# EAGLE design LED Balloon_driver IC (EAGLE 9.6.2)
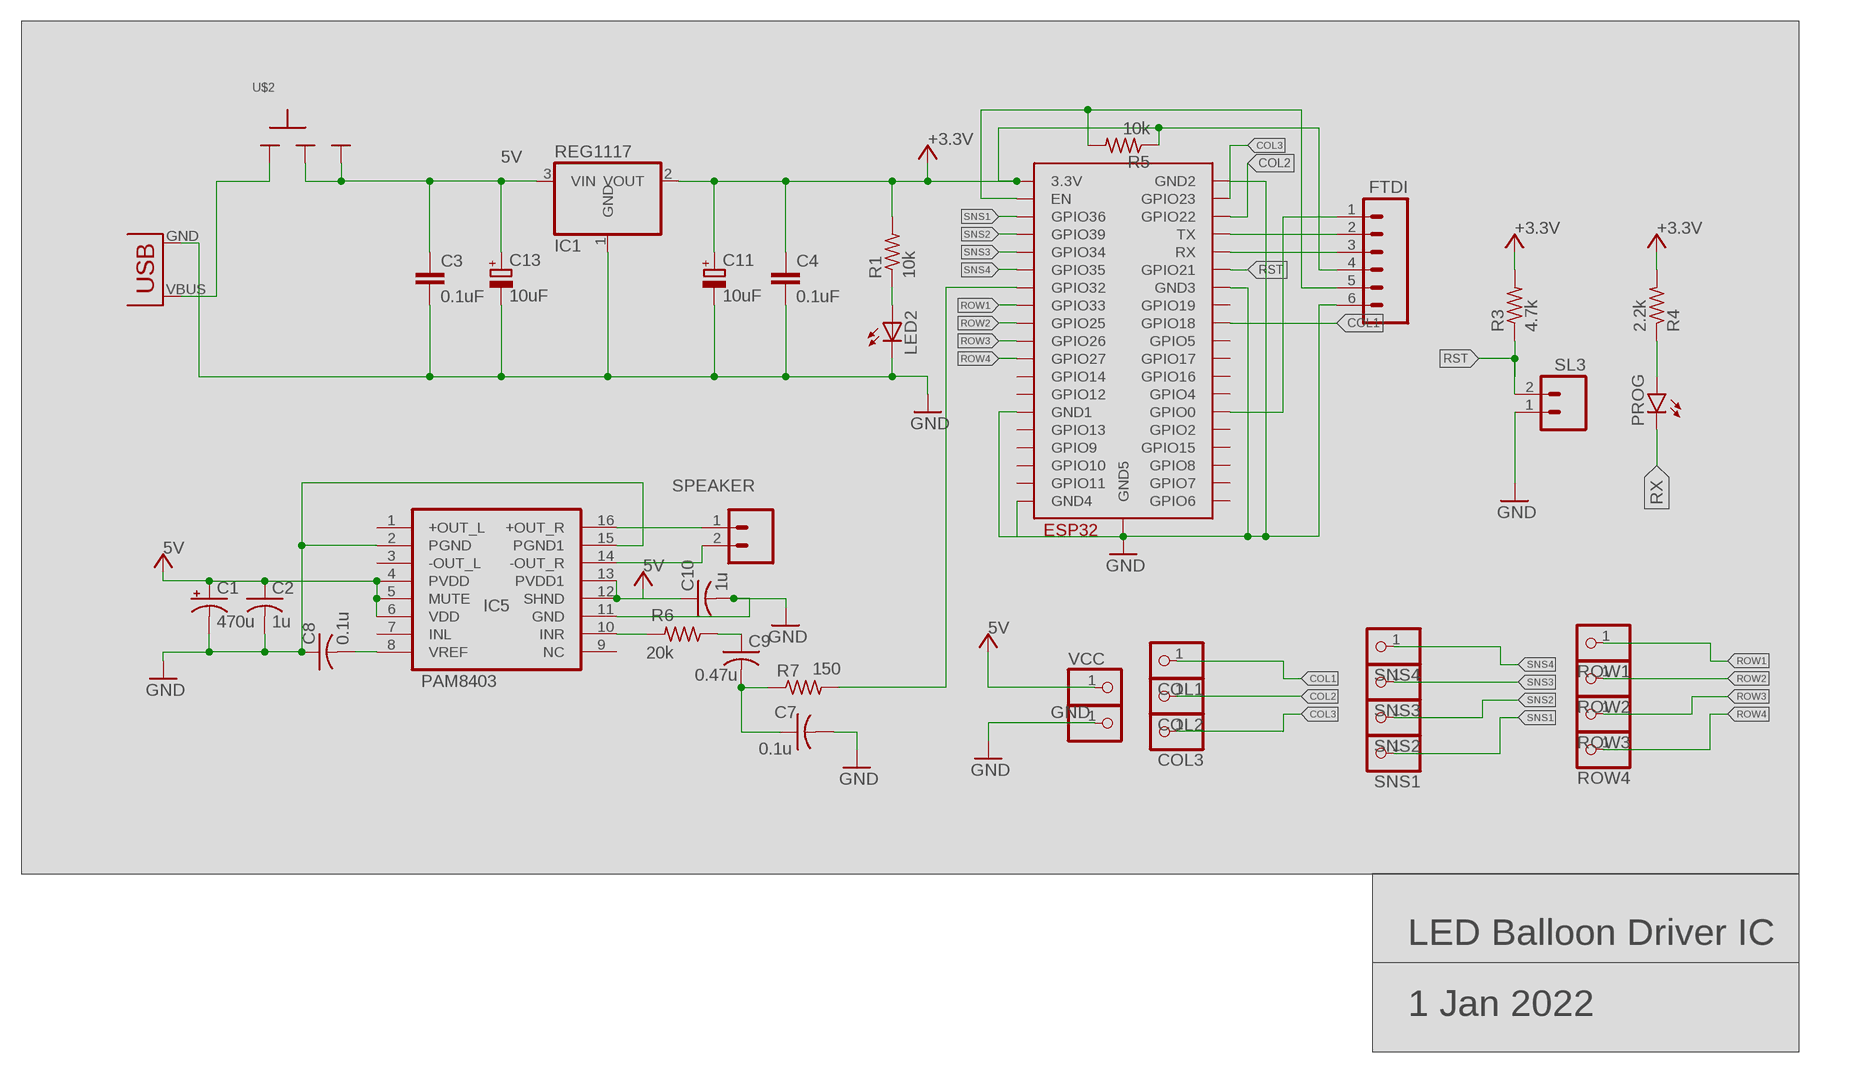
[diagram p0: schematic, sheet 1]

## Parts
C1  470u  CPOL-USE5-10.5  [E5-10,5]
C2  1u  CAP0805  [C0805]
C3  0.1uF  C2,5-3  [C2.5-3]
C4  0.1uF  C2,5-3  [C2.5-3]
C7  0.1u  CAP0805  [C0805]
C8  0.1u  CAP0805  [C0805]
C9  0.47u  CAP0805  [C0805]
C10  1u  CAP0805  [C0805]
C11  10uF  CPOL-EUE2-5  [E2-5]
C13  10uF  CPOL-EUE2-5  [E2-5]
COL1  PINHD-1X1  [1X01]
COL2  PINHD-1X1  [1X01]
COL3  PINHD-1X1  [1X01]
ESP32_MODULE  ESP32-WROOM  [ESP32-WROOM]
GND  PINHD-1X1  [1X01]
IC1  REG1117  [SOT223]
IC5  PAM8403  [SOP-16]
LED2  LED5MM  [LED5MM]
PROG  LED-RED0603  [0603-RED]
R1  10k  RESISTOR0207/7  [0207/7]
R3  4.7k  RESISTOR0207/7  [0207/7]
R4  2.2k  RESISTOR0805  [R0805]
R5  10k  RESISTOR0805  [R0805]
R6  20k  R-US_0207/10  [0207/10]
R7  150  R-US_0207/10  [0207/10]
ROW1  PINHD-1X1  [1X01]
ROW2  PINHD-1X1  [1X01]
ROW3  PINHD-1X1  [1X01]
ROW4  PINHD-1X1  [1X01]
SL1  FTDI  M06  [06P]
SL3  M02  [02P]
SNS1  PINHD-1X1  [1X01]
SNS2  PINHD-1X1  [1X01]
SNS3  PINHD-1X1  [1X01]
SNS4  PINHD-1X1  [1X01]
SPEAKER  M02  [02P]
U$1  USB(POWER)  [USB(POWER)]
U$2  SLIDESWITCH-BIG  [BIGSWITCH]
VCC  PINHD-1X1  [1X01]

## Nets
5V: C1.+ C2.1 C3.1 C10.1 C13.+ IC1.3(VIN) IC5.4(PVDD) IC5.5(MUTE) IC5.6(VDD) IC5.12(SHND) IC5.13(PVDD1) U$2.2 U$2.3 VCC.1 ; supply symbol labelled VCC
+3.3V: C4.1 C11.+ ESP32_MODULE.3V3(3.3V) IC1.2(VOUT) R1.2 R3.2 R4.2 R5.1 SL1.4 ; supply symbol labelled VCC
COL1: COL1.1 ESP32_MODULE.IO18(GPIO18)
COL2: COL2.1 ESP32_MODULE.IO22(GPIO22)
COL3: COL3.1 ESP32_MODULE.IO23(GPIO23)
EN: ESP32_MODULE.EN R5.2 SL1.5
GND: C1.- C2.2 C3.2 C4.2 C7.2 C8.1 C10.2 C11.- C13.- ESP32_MODULE.GND1 ESP32_MODULE.GND2 ESP32_MODULE.GND3 ESP32_MODULE.GND4 ESP32_MODULE.GND5 GND.1 IC1.1(GND) IC5.2(PGND) IC5.11(GND) IC5.15(PGND1) LED2.K(C) SL1.6 SL3.1 U$1.GND
N$1: IC5.16(+OUT_R) SPEAKER.1
N$2: IC5.10(INR) R6.2
N$3: C8.2 IC5.8(VREF)
N$4: PROG.A R4.1
N$5: C9.1 R6.1
N$6: ESP32_MODULE.IO0(GPIO0) SL1.1
N$8: IC5.14(-OUT_R) SPEAKER.2
N$9: LED2.A R1.1
N$10: C7.1 C9.2 R7.1
N$11: U$1.VBUS(VCC) U$2.1
PWM: ESP32_MODULE.IO32(GPIO32) R7.2
ROW1: ESP32_MODULE.IO33(GPIO33) ROW1.1
ROW2: ESP32_MODULE.IO25(GPIO25) ROW2.1
ROW3: ESP32_MODULE.IO26(GPIO26) ROW3.1
ROW4: ESP32_MODULE.IO27(GPIO27) ROW4.1
RST: ESP32_MODULE.IO21(GPIO21) R3.1 SL3.2
RX: ESP32_MODULE.RX PROG.C SL1.3
SNS1: ESP32_MODULE.SENSOR_VP(GPIO36) SNS1.1
SNS2: ESP32_MODULE.SENSOR_VN(GPIO39) SNS2.1
SNS3: ESP32_MODULE.IO34(GPIO34) SNS3.1
SNS4: ESP32_MODULE.IO35(GPIO35) SNS4.1
TX: ESP32_MODULE.TX SL1.2
Unconnected: ESP32_MODULE.CLK(GPIO6) ESP32_MODULE.CMD(GPIO11) ESP32_MODULE.IO2(GPIO2) ESP32_MODULE.IO4(GPIO4) ESP32_MODULE.IO5(GPIO5) ESP32_MODULE.IO12(GPIO12) ESP32_MODULE.IO13(GPIO13) ESP32_MODULE.IO14(GPIO14) ESP32_MODULE.IO15(GPIO15) ESP32_MODULE.IO16(GPIO16) ESP32_MODULE.IO17(GPIO17) ESP32_MODULE.IO19(GPIO19) ESP32_MODULE.SD0(GPIO7) ESP32_MODULE.SD1(GPIO8) ESP32_MODULE.SD2(GPIO9) ESP32_MODULE.SD3(GPIO10) IC5.1(+OUT_L) IC5.3(-OUT_L) IC5.7(INL) IC5.9(NC)

## Notes on the sheet
- LED Balloon Driver IC
- 1 Jan 2022

## Library data of the parts
C1 = rcl:CPOL-US: POLARIZED CAPACITOR, American symbol; SPICEPREFIX: C
C2 C7-C10 = CEDT_JANUARY_2015_v6:CAP
C3 C4 = capacitor-wima:C: CAPACITOR naming: grid - package width
C11 C13 = rcl:CPOL-EU: POLARIZED CAPACITOR, European symbol; SPICEPREFIX: C
COL1-COL3 GND ROW1-ROW4 SNS1-SNS4 VCC = adafruit:PINHD-1X1: Pin header 1x1 for 0.1" spacing With round pins
ESP32_MODULE = ESP32:ESP32-WROOM
IC1 = CEDT_JANUARY_2015_v6:REG1117: 800mA and 1A Low Dropout (LDO) Positive Regulator 1.8V, 2.5V, 2.85V, 3.3V, 5V, and Adj
IC5 = PAM8403:PAM8403: Dual channel audio amplifier IC - PAM8403
LED2 = adafruit:LED: LED OSRAM: - CHIPLED LG R971, LG N971, LY N971, LG Q971, LY Q971, LO R971, LY R971 LH N974, LH R974 LS Q976, LO Q976, LY Q976 LO Q996 - Hyper CHIPLED LW Q18S LB Q993, LB Q99A, LB R99A - SideLED LS A670, LO A670, LY A670, LG A670, LP A670 LB A673, LV A673, LT A673, LW A673 LH A674 LY A675 LS A676, LA A676, LO A676, LY A676, LW A676 LS A679, LY A679, LG A679 - Hyper Micro SIDELED® LS Y876, LA Y876, LO Y876, LY Y876 LT Y87S - SmartLED LW L88C, LW L88S LB L89C, LB L89S, LG L890 LS L89K, LO L89K, LY L89K LS L896, LA L896, LO L896, LY L896 - TOPLED LS T670, LO T670, LY T670, LG T670, LP T670 LSG T670, LSP T670, LSY T670, LOP T670, LYG T670 LG T671, LOG T671, LSG T671 LB T673, LV T673, LT T673, LW T673 LH T674 LS T676, LA T676, LO T676, LY T676, LB T676, LH T676, LSB T676, LW T676 LB T67C, LV T67C, LT T67C, LS T67K, LO T67K, LY T67K, LW E67C LS E67B, LA E67B, LO E67B, LY E67B, LB E67C, LV E67C, LT E67C LW T67C LS T679, LY T679, LG T679 LS T770, LO T770, LY T770, LG T770, LP T770 LB T773, LV T773, LT T773, LW T773 LH T774 LS E675, LA E675, LY E675, LS T675 LS T776, LA T776, LO T776, LY T776, LB T776 LHGB T686 LT T68C, LB T68C - Hyper Mini TOPLED® LB M676 - Mini TOPLED Santana® LG M470 LS M47K, LO M47K, LY M47K Source: http://www.osram.convergy.de/
PROG = BeagleBone_Blue_R3:LED-RED
R1 R3-R5 = CEDT_JANUARY_2015_v6:RESISTOR
R6 R7 = adafruit:R-US_: RESISTOR, American symbol
SL1 = con-amp-quick:M06: AMP QUICK CONNECTOR; OC_FARNELL: unknown; OC_NEWARK: unknown
SL3 = con-amp-quick:M02: AMP QUICK CONNECTOR; OC_FARNELL: unknown; OC_NEWARK: unknown
SPEAKER = CEDT_JANUARY_2015_v6:M02: AMP QUICK CONNECTOR
U$1 = CEDT_JANUARY_2015_v6:USB(POWER)
U$2 = CEDT_JANUARY_2015_v6:SLIDESWITCH

## Board
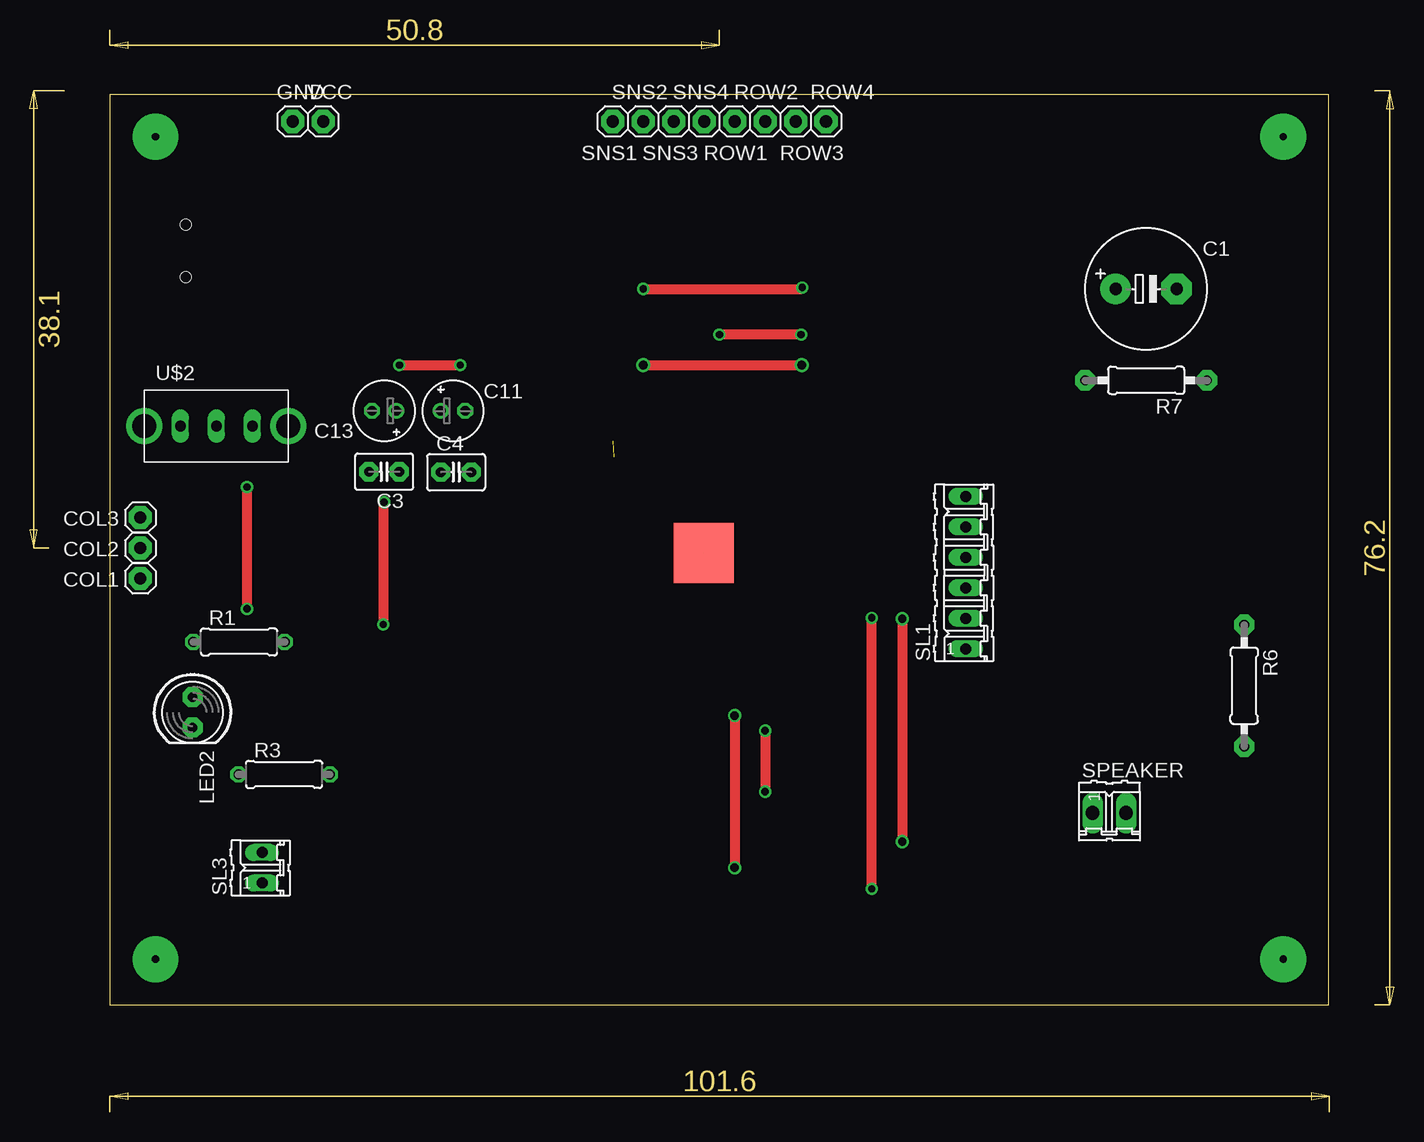
[diagram p1: board, top side]
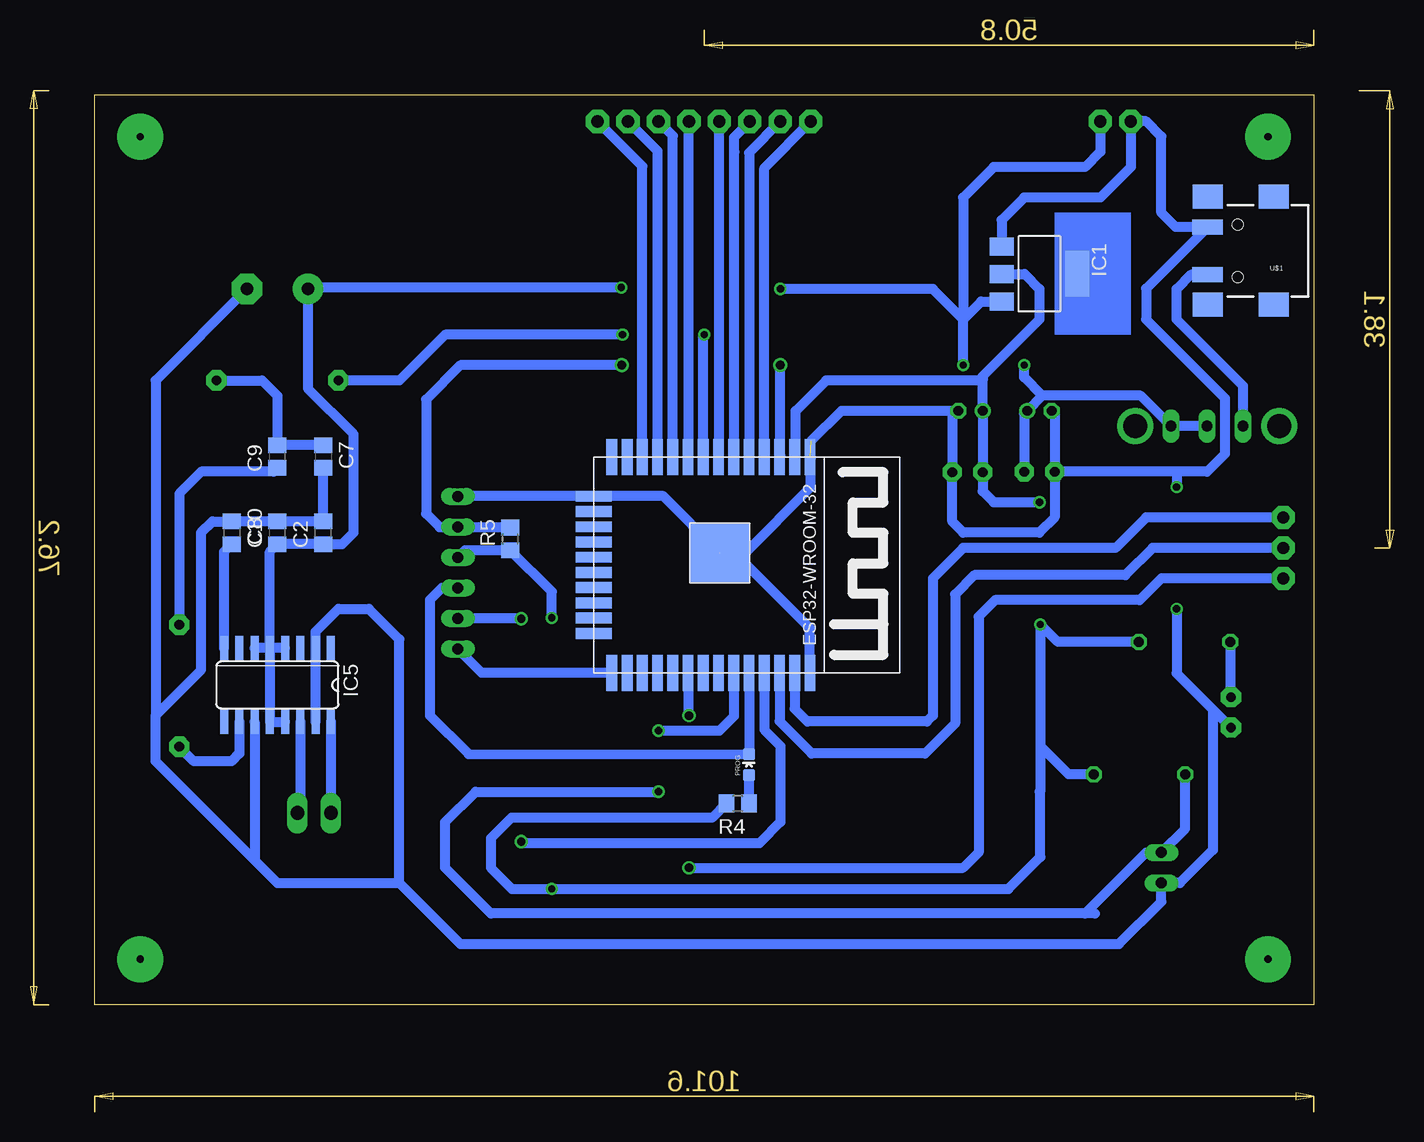
[diagram p2: board, bottom side, seen from below]

Size 101.58 x 75.87 mm. Coordinates in mm from the lower left corner, seen from the top.
Outline: 0,0 101.58,0 101.58,75.87 0,75.87 0,0
Copper layers (1*16): Top 0.035mm / dielectric 1.5mm / Bottom 0.035mm
Design rules "default": minimum track width 6mil, minimum drill 0.35mm, track to track 6mil, track to pad 6mil, pad to pad 6mil, via to via 6mil, smd to smd 6mil, copper to edge 40mil, drill to drill 6mil, minimum pad ring 10mil, minimum via ring 8mil, stop-mask expansion 4mil, vias tented up to drill 0mil, thermal gap 10mil

### Footprints (pad centres in the part's own frame; a part is rotated, then mirrored left to right if it is on the bottom)
E5-10,5 = drill 1.016 pad 2.54: + -2.54,0 | drill 1.016 pad 2.54 octagon: - 2.54,0
C0805 = smd 1.3 x 1.5: 1 -0.95,0; 2 0.95,0
C2.5-3 = drill 0.813 pad 1.6 octagon: 1 -1.27,0; 2 1.27,0
E2-5 = drill 0.813 pad 1.27: + -1.016,0 | drill 0.813 pad 1.27 octagon: - 1.016,0
1X01 = drill 1.016 pad 1.93 octagon: 1 0,0
ESP32-WROOM = smd 3 x 0.9: 3V3 0,16.74; EN 0,15.47; GND1 0,18.01; GND3 18,18.01; IO0 18,1.5; IO4 18,2.77; IO5 18,6.58; IO12 0,1.5; IO14 0,2.77; IO16 18,4.04; IO17 18,5.31; IO18 18,7.85; IO19 18,9.12; IO21 18,11.66; IO22 18,15.47; IO23 18,16.74; IO25 0,6.58; IO26 0,5.31; IO27 0,4.04; IO32 0,9.12; IO33 0,7.85; IO34 0,11.66; IO35 0,10.39; NC 18,10.39; RX 18,12.93; SENSOR_VN 0,12.93; SENSOR_VP 0,14.2; TX 18,14.2 | smd 0.9 x 3: CLK 9.635,0; CMD 8.365,0; GND2 3.285,0; IO2 14.715,0; IO13 4.555,0; IO15 13.445,0; SD0 10.905,0; SD1 12.175,0; SD2 5.825,0; SD3 7.095,0 | smd 5 x 5: GND4 8,10.5 | smd 5 x 5 bottom: GND5 8,10.5
SOT223 = smd 1.499 x 2.007: 1 -2.261,-3.15; 2 0.025,-3.15; 3 2.311,-3.15 | smd 3.81 x 2.007: 4 0,3.15
SOP-16 = smd 0.66 x 2.032: 1 -4.445,-3.073; 2 -3.175,-3.073; 3 -1.905,-3.073; 4 -0.635,-3.073; 5 0.635,-3.073; 6 1.905,-3.073; 7 3.175,-3.073; 8 4.445,-3.073; 9 4.445,3.073; 10 3.175,3.073; 11 1.905,3.073; 12 0.635,3.073; 13 -0.635,3.073; 14 -1.905,3.073; 15 -3.175,3.073; 16 -4.445,3.073
LED5MM = drill 0.813 pad 1.676 octagon: A -1.27,0; K 1.27,0
0603-RED = smd 1 x 1: A 0,-0.877; C 0,0.877
0207/7 = drill 0.813 octagon: 1 -3.81,0; 2 3.81,0
R0805 = smd 1.3 x 1.5: 1 -0.95,0; 2 0.95,0
0207/10 = drill 0.813 pad 1.676 octagon: 1 -5.08,0; 2 5.08,0
06P = drill 0.914 long: 1 -6.35,0; 2 -3.81,0; 3 -1.27,0; 4 1.27,0; 5 3.81,0; 6 6.35,0
02P = drill 0.914 long: 1 -1.27,0; 2 1.27,0
02P' = drill 1.143 long: 1 -1.397,0; 2 1.397,0
USB(POWER) = smd 2.54 x 1.27: GND 2.5,-1.981; VBUS 2.5,1.981 | smd 2.5 x 2: GND@1 -3,-4.5; GND@2 -3,4.5; GND@3 2.5,4.5; GND@4 2.5,-4.5 | hole 0.9: 0,2.2; 0,-2.2
BIGSWITCH = drill 0.9 long: 1 -3,0; 2 0,0; 3 3,0 | drill 2 pad 2.184: TAB1 -6,0; TAB2 6,0

### Placement (x,y rotation side)
C1  86.36,59.69 0 top
C2  82.55,39.37 90 bottom
C3  22.86,44.45 180 top
C4  28.85,44.41 0 top
C7  82.55,45.72 270 bottom
C8  90.17,39.37 270 bottom
C9  86.36,45.72 90 bottom
C10  86.36,39.37 90 bottom
C11  28.6,49.53 0 top
C13  22.86,49.53 180 top
COL1  2.54,35.56 0 top
COL2  2.54,38.1 0 top
COL3  2.54,40.64 0 top
ESP32_MODULE  59.99,45.69 270 bottom
GND  15.24,73.66 0 top
IC1  22.86,60.96 270 bottom
IC5  86.36,26.67 180 bottom
LED2  6.9,24.39 270 top
PROG  47.07,20.02 0 bottom
R1  10.76,30.26 0 top
R3  14.53,19.22 0 top
R4  48,16.79 180 bottom
R5  66.95,38.85 90 bottom
R6  94.53,26.61 270 top
R7  86.36,52.07 180 top
ROW1  52.07,73.66 0 top
ROW2  54.61,73.66 0 top
ROW3  57.15,73.66 0 top
ROW4  59.69,73.66 0 top
SL1  71.33,36.03 90 top
SL3  12.7,11.43 90 top
SNS1  41.91,73.66 0 top
SNS2  44.45,73.66 0 top
SNS3  46.99,73.66 0 top
SNS4  49.53,73.66 0 top
SPEAKER  [02P']  83.29,16 0 top
U$1  6.35,62.87 180 bottom
U$2  8.89,48.26 0 top
VCC  17.78,73.66 0 top

### Tracks (layer width: path | path; a pad name or v marks a point on that pad's centre or on a via)
5V  (via drill 0.61 pad 0.7)
  Top 0.813: v24.13,53.34 v29.21,53.34 | v44.45,59.69 57.66,59.69 57.74,59.78 v57.71,59.81
  Bottom 0.813: 22.61,50.8 C13.+ 24.13,49.28 C3.1 | U$2.2 U$2.3 14.43,50.8 22.61,50.8 | 22.61,50.8 24.13,52.32 v24.13,53.34 | v29.21,53.34 29.21,57.15 | 29.21,57.15 27.71,58.65 IC1.3 | VCC.1 17.78,71.12 19.05,69.85 26.67,69.85 29.21,67.31 29.21,57.15 | v44.45,59.69 31.75,59.69 29.21,57.15 | v57.71,59.81 83.7,59.81 C1.+ 83.82,51.39 80.01,47.58 80.01,39.37 80.96,38.42 C2.1 C10.1 87,37.78 IC5.5 | IC5.4 IC5.5 | IC5.5 IC5.6 | IC5.5 IC5.12 IC5.13
+3.3V  (via drill 0.61 pad 0.7)
  Top 0.813: v22.86,41.91 22.79,41.84 v22.79,31.72 | v63.5,9.67 v63.5,32.27
  Bottom 0.813: SL1.4 70.73,37.9 R5.1 63.5,34.45 v63.5,32.27 | IC1.2 24.11,60.94 22.86,59.69 22.86,57.15 27.59,52.42 27.59,52.07 | 27.59,52.07 C11.+ C4.1 27.59,42.83 26.67,41.91 v22.86,41.91 | ESP32_MODULE.3V3 43.18,45.77 43.18,49.53 40.64,52.07 27.59,52.07 | 22.79,21.59 v22.79,31.72 21.33,30.26 R1.2 | 22.79,21.59 22.79,17.85 | 22.79,17.85 22.86,17.78 | R4.2 50.14,15.6 66.87,15.6 68.58,13.89 68.58,11.43 66.82,9.67 v63.5,9.67 25.46,9.67 22.79,12.34 22.79,17.85 | R3.2 20.42,19.22 22.79,21.59
COL1  (via drill 0.7)
  Top 0.813: v52.07,24.13 v52.07,11.43
  Bottom 0.813: ESP32_MODULE.IO18 52.14,24.2 v52.07,24.13 | v52.07,11.43 29.21,11.43 27.94,12.7 27.94,32.37 26.56,33.74 14.52,33.74 12.7,35.56 COL1.1
COL2
  Bottom 0.813: ESP32_MODULE.IO22 44.52,23.65 41.83,20.96 32.38,20.96 29.88,23.46 29.88,34.23 28.27,35.83 15.69,35.83 13.42,38.1 COL2.1
COL3
  Bottom 0.813: ESP32_MODULE.IO23 43.25,24.68 42.2,23.63 32.25,23.63 31.75,24.13 31.75,35.56 29.21,38.1 16.51,38.1 13.97,40.64 COL3.1
EN  (via drill 0.75)
  Top 0.813: v44.45,53.34 v57.66,53.34
  Bottom 0.813: ESP32_MODULE.EN 44.45,45.77 v44.45,53.34 | v57.66,53.34 71.12,53.34 73.97,50.49 73.97,40.95 72.84,39.82 71.35,39.82 | 71.35,39.82 SL1.5 | R5.2 71.32,39.8 71.35,39.82
GND  (via drill 0.61 pad 0.7)  (2 unrouted)
  Top 0.813: v11.43,43.18 v11.43,33.02
  Bottom 0.813: SL1.6 71.3,42.41 ESP32_MODULE.GND2 54.21,42.41 ESP32_MODULE.GND4 48.26,37.69 | 48.26,37.69 47.4,37.69 41.91,43.18 41.91,45.62 ESP32_MODULE.GND1 | ESP32_MODULE.GND3 41.98,31.41 48.26,37.69 | IC1.1 26.01,65.43 24.13,67.31 17.78,67.31 15.24,69.85 GND.1 13.97,73.66 12.7,72.39 12.7,66.04 11.51,64.85 U$1.GND 13.97,59.73 13.97,57.15 7.4,50.58 7.4,45.93 8.88,44.45 11.42,44.45 | C13.- 21.59,49.28 C3.2 | 41.91,46.99 39.37,49.53 C11.- 30.12,49.02 C4.2 30.12,40.28 29.21,39.37 22.86,39.37 21.59,40.64 C3.2 | 11.42,44.45 C3.2 | 11.42,44.45 11.43,44.44 v11.43,43.18 | 8.4,24.62 11.43,27.65 v11.43,33.02 | 8.4,24.62 LED2.K | 8.4,24.62 8.4,12.91 11.15,10.16 SL3.1 12.7,8.61 16.23,5.08 71.12,5.08 76.2,10.16 | 76.2,10.16 76.2,30.48 78.74,33.02 81.28,33.02 83.19,31.11 IC5.2 IC5.15 | IC5.11 88.27,12.06 | 76.2,10.16 86.36,10.16 88.27,12.06 | C7.2 C2.2 C10.2 C8.1 91.76,40.32 92.71,39.37 92.71,27.94 96.52,24.13 | 88.27,12.06 96.52,20.32 96.52,24.13 | C1.- 96.52,52.07 96.52,24.13
N$1
  Bottom 0.813: IC5.16 81.92,16.02 SPEAKER.1
N$2
  Bottom 0.813: IC5.10 89.53,20.95 90.17,20.32 93.32,20.32 R6.2
N$3
  Bottom 0.813: IC5.8 90.81,37.78 C8.2
N$4
  Bottom 0.813: PROG.A 47.07,16.81 R4.1
N$5
  Bottom 0.813: C9.1 86.68,44.45 92.71,44.45 94.53,42.63 R6.1
N$6
  Bottom 0.813: ESP32_MODULE.IO0 69.34,27.69 SL1.1
N$7  (via drill 0.61 pad 3.81)
  other vias: 3.81,72.39
N$8
  Bottom 0.813: IC5.14 84.45,16.24 SPEAKER.2
N$9
  Bottom 0.813: R1.1 6.95,25.72 LED2.A
N$10
  Bottom 0.813: C7.1 C9.2 86.36,50.8 87.63,52.07 R7.1
N$11
  Bottom 0.813: U$1.VBUS 10.24,60.88 11.43,59.69 11.43,57.15 5.89,51.61 U$2.1
N$12  (via drill 0.61 pad 3.81)
  other vias: 3.81,3.81
N$13  (via drill 0.61 pad 3.81)
  other vias: 97.79,3.81
N$14  (via drill 0.61 pad 3.81)
  other vias: 97.79,72.39
PWM  (via drill 0.61 pad 0.7)
  Top 0.813: v50.8,55.88 50.87,55.95 57.61,55.95 v57.61,55.88
  Bottom 0.813: ESP32_MODULE.IO32 50.87,55.81 v50.8,55.88 | v57.61,55.88 72.39,55.88 76.2,52.07 R7.2
ROW1
  Bottom 0.813: ROW1.1 52.14,73.59 ESP32_MODULE.IO33
ROW2
  Bottom 0.813: ESP32_MODULE.IO25 53.41,72.46 ROW2.1
ROW3
  Bottom 0.813: ESP32_MODULE.IO26 54.68,71.19 ROW3.1
ROW4
  Bottom 0.813: ESP32_MODULE.IO27 55.95,69.92 ROW4.1
RST  (via drill 0.61 pad 0.7)
  Top 0.813: v54.61,22.86 v54.61,17.78
  Bottom 0.813: ESP32_MODULE.IO21 48.33,24.06 49.53,22.86 v54.61,22.86 | v54.61,17.78 69.85,17.78 72.39,15.24 72.39,11.43 68.58,7.62 19.05,7.62 | 18.21,7.62 19.05,7.62 | 10.87,19.06 R3.1 10.72,14.68 SL3.2 13.97,12.7 19.05,7.62
RX
  Bottom 0.813: ESP32_MODULE.RX 47.06,20.99 PROG.C 70.44,20.91 73.66,24.13 73.66,33.76 72.66,34.76 SL1.3
SNS1
  Bottom 0.813: ESP32_MODULE.SENSOR_VP 45.79,69.78 SNS1.1
SNS2
  Bottom 0.813: ESP32_MODULE.SENSOR_VN 47.06,71.05 SNS2.1
SNS3
  Bottom 0.813: 48.33,71.05 48.26,71.12 | 48.33,71.05 ESP32_MODULE.IO34 | SNS3.1 48.33,72.32 48.33,71.05
SNS4
  Bottom 0.813: SNS4.1 49.6,73.59 ESP32_MODULE.IO35
TX  (via drill 0.7)
  Top 0.813: v66.04,32.2 v66.03,32.2 v66.03,13.63 v66.04,13.62
  Bottom 0.813: ESP32_MODULE.TX 45.79,22.93 44.45,21.59 44.45,15.24 46.19,13.5 65.92,13.5 v66.04,13.62 | v66.04,32.2 71.31,32.2 SL1.2
(copper drawn outside any net)
  shapes: Bottom area x2